# Altium schematic sheet PoE.SchDoc
size A2
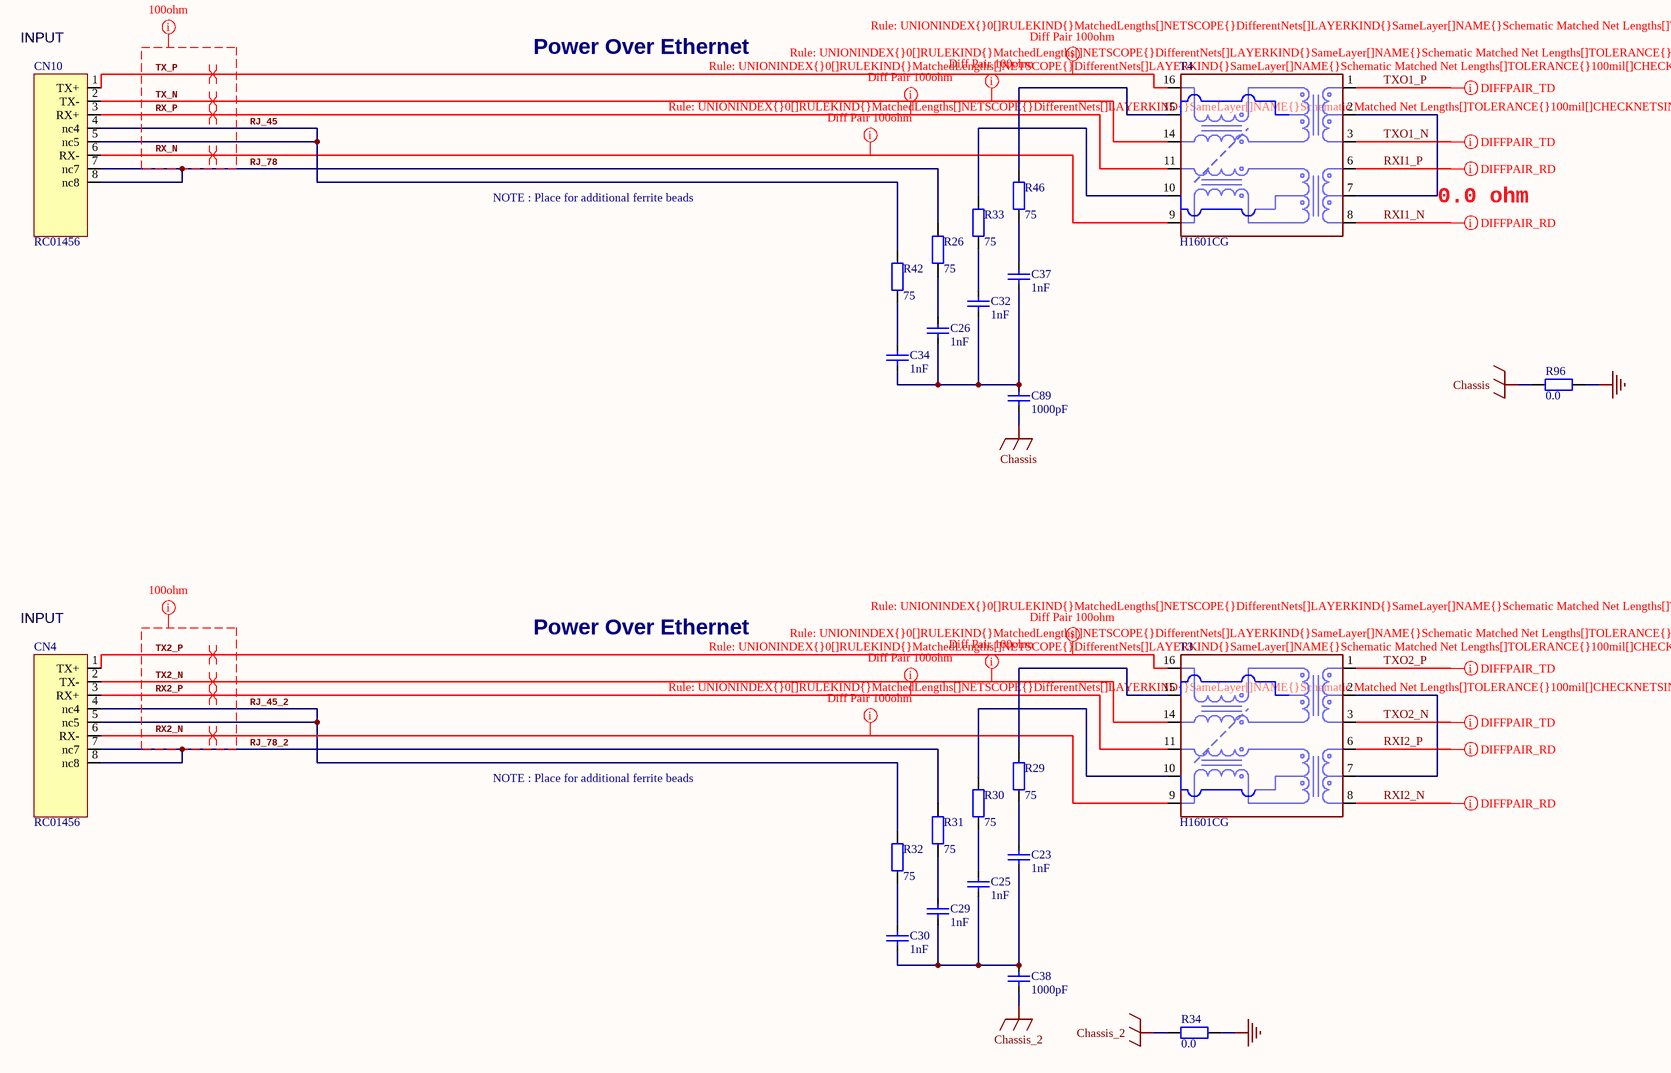
[diagram p0: PoE.SchDoc]

## Parts
C23  value 1nF  [CAP0603R]  (hidden comment: CL10B102KC8NNNC)
C25  value 1nF  [CAP0603R]  (hidden comment: CL10B102KC8NNNC)
C26  value 1nF  [CAP0603R]  (hidden comment: CL10B102KC8NNNC)
C29  value 1nF  [CAP0603R]  (hidden comment: CL10B102KC8NNNC)
C30  value 1nF  [CAP0603R]  (hidden comment: CL10B102KC8NNNC)
C32  value 1nF  [CAP0603R]  (hidden comment: CL10B102KC8NNNC)
C34  value 1nF  [CAP0603R]  (hidden comment: CL10B102KC8NNNC)
C37  value 1nF  [CAP0603R]  (hidden comment: CL10B102KC8NNNC)
C38  value 1000pF  [CAP1206R]  (hidden comment: CC1206KKX7RDBB102)
C89  value 1000pF  [CAP1206R]  (hidden comment: CC1206KKX7RDBB102)
CN4  RC01456  [HY506-Footprint-1]
CN10  RC01456  [HY506-Footprint-1]
R26  value 75  [0603]  (hidden comment: 0603WAF750JT5E)
R29  value 75  [0603]  (hidden comment: 0603WAF750JT5E)
R30  value 75  [0603]  (hidden comment: 0603WAF750JT5E)
R31  value 75  [0603]  (hidden comment: 0603WAF750JT5E)
R32  value 75  [0603]  (hidden comment: 0603WAF750JT5E)
R33  value 75  [0603]  (hidden comment: 0603WAF750JT5E)
R34  value 0.0  [0805]  (hidden comment: CMP-022-0137-1)
R42  value 75  [0603]  (hidden comment: 0603WAF750JT5E)
R46  value 75  [0603]  (hidden comment: 0603WAF750JT5E)
R96  value 0.0  [0805]  (hidden comment: CMP-022-0137-1)
T3  H1601CG  [TF-16SM]
T4  H1601CG  [TF-16SM]

## Nets
Chassis: C89.1 R96.1
Chassis_2: C38.1 R34.1
GND: R34.2 R96.2
RJ_45: CN10.4(nc4) CN10.5(nc5) R42.2
RJ_45_2: CN4.4(nc4) CN4.5(nc5) R32.2
RJ_78: CN10.7(nc7) CN10.8(nc8) R26.2
RJ_78_2: CN4.7(nc7) CN4.8(nc8) R31.2
RX2_N: CN4.6(RX-) T3.9(RX-)
RX2_P: CN4.3(RX+) T3.11(RX1+)
RX_N: CN10.6(RX-) T4.9(RX-)
RX_P: CN10.3(RX+) T4.11(RX1+)
RXI1_N: T4.8(RD-)
RXI1_P: T4.6(RD+)
RXI2_N: T3.8(RD-)
RXI2_P: T3.6(RD+)
TX2_N: CN4.2(TX-) T3.14(TX1-)
TX2_P: CN4.1(TX+) T3.16(TX1+)
TX_N: CN10.2(TX-) T4.14(TX1-)
TX_P: CN10.1(TX+) T4.16(TX1+)
TXO1_N: T4.3(TD-)
TXO1_P: T4.1(TD+)
TXO2_N: T3.3(TD-)
TXO2_P: T3.1(TD+)
NetC23_1: C23.1 C25.1 C29.1 C30.1 C38.2
NetC23_2: C23.2 R29.1
NetC25_2: C25.2 R30.1
NetC26_1: C26.1 C32.1 C34.1 C37.1 C89.2
NetC26_2: C26.2 R26.1
NetC29_2: C29.2 R31.1
NetC30_2: C30.2 R32.1
NetC32_2: C32.2 R33.1
NetC34_2: C34.2 R42.1
NetC37_2: C37.2 R46.1
NetR29_2: R29.2 T3.15(CT)
NetR30_2: R30.2 T3.10(CT)
NetR33_2: R33.2 T4.10(CT)
NetR46_2: R46.2 T4.15(CT)
NetT3_2: T3.2(CT) T3.7(CT)
NetT4_2: T4.2(CT) T4.7(CT)

## Layout directives
rule Matched Net Lengths [Tolerance = 100mil]: RX2_N, RX2_P, RX_N, RX_P, TX2_N, TX2_P, TX_N, TX_P
differential pair: RX2_N, RX2_P, RX_N, RX_P, RXI1_N, RXI1_P, RXI2_N, RXI2_P, TX2_N, TX2_P, TX_N, TX_P, TXO1_N, TXO1_P, TXO2_N, TXO2_P
net class 100ohm: RX2_N, RX2_P, RX_N, RX_P, TX2_N, TX2_P, TX_N, TX_P

## Notes on the sheet
- (near CN10) INPUT
- Power Over Ethernet
- NOTE : Place for additional ferrite beads
- 0.0 ohm
- (near CN4) INPUT

## Library data of the parts
C23 C25 C26 C29 C30 C32 C34 C37 = CMP-00190-1: CAP CER 1000PF 100V ±10% X7R 0603; Manufacturer: Samsung; Price: 0,0043; Tolerance: ±10%; Simulation: CAP; Voltage: 100V; PriceQty: 50; PriceSupplier: https://lcsc.com/product-detail/Multilayer-Ceramic-Capacitors-MLCC-SMD-SMT_SAMSUNG_CL10B102KC8NNNC_1nF-102-10-100V_C153291.html; Designator: CL10B102KC8NNNC; Signal Integrity: Cap; Pin Count: 2; HelpURL: https://lcsc.com/product-detail/Multilayer-Ceramic-Capacitors-MLCC-SMD-SMT_SAMSUNG_CL10B102KC8NNNC_1nF-102-10-100V_C153291.html; Component Name: CL10B102KC8NNNC; Part Number: CL10B102KC8NNNC; Technology: X7R; Temperature: -55°C ~ 125°C
C38 C89 = CMP-004-0061-2: CAP CER 1000PF 2KV ±10% X7R 1206; Manufacturer: Yageo; Tolerance: ±10%; Voltage: 2kV; Technology: X7R; Part Number: CC1206KKX7RDBB102; Temperature: -55°C ~ 125°C; HelpURL: https://www.digikey.com/product-detail/en/yageo/CC1206KKX7RDBB102/311-1487-1-ND/2833793; Price: 0,0114; PriceQty: 50; PriceSupplier: https://lcsc.com/product-detail/Multilayer-Ceramic-Capacitors-MLCC-SMD-SMT_YAGEO-CC1206KKX7RDBB102_C23631.html; Simulation: CAP; Signal Integrity: Cap; Component Name: CC1206KKX7RDBB102; Pin Count: 2
CN4 CN10 = CMP-00197-2: 8 Pin RJ45 Socket; Manufacturer: RCH; Price: 0,0476; PriceQty: 120; Designator: RC01456; PriceSupplier: https://lcsc.com/product-detail/Ethernet-Connectors-Modular-Connectors-RJ45-RJ11_RCH-RC01456_C708633.html; Part Number: RC01456; Pin Count: 8; Component Name: RC01456; Temperature: -40°c~85°c; HelpURL: https://lcsc.com/product-detail/Ethernet-Connectors-Modular-Connectors-RJ45-RJ11_RCH-RC01456_C708633.html
R26 R29-R33 R42 R46 = CMP-00189-1: RES SMD 75 OHM 1% 1/10W 0603; Manufacturer: Uniroyal; Pin Count: 2; Simulation: RESISTOR; HelpURL: https://lcsc.com/product-detail/Chip-Resistor-Surface-Mount_Uniroyal-Elec-0603WAF750JT5E_C4275.html; Price: 0,0023; Designator: 0603WAF750JT5E; PriceQty: 1; Part Number: 0603WAF750JT5E; Signal Integrity: Res; Tolerance: ±1%; PriceSupplier: https://lcsc.com/product-detail/Chip-Resistor-Surface-Mount_Uniroyal-Elec-0603WAF750JT5E_C4275.html; Temperature: -55°C ~ 155°C; Component Name: 0603WAF750JT5E
R34 R96 = CMP-022-0137-1: RES SMD 0 OHM JUMPER 1/8W 0805; Part Number: RC0805JR-070RL; Manufacturer: Yageo; Temperature: -55°C ~ 155°C; HelpURL: https://www.digikey.com/product-detail/en/yageo/RC0805JR-070RL/311-0.0ARCT-ND/731163; Price: 0,001203; PriceQty: 100; PriceSupplier: https://lcsc.com/product-detail/Chip-Resistor-Surface-Mount_YAGEO-RC0805JR-070RL_C96345.html; Component Name: RC0805JR-070RL; Pin Count: 2; Signal Integrity: Res; Simulation: RESISTOR
T3 T4 = CMP-00191-2: 1:1 350 -1.1 -18 SMD-16 RJ45 Transformer; Manufacturer: Dongguan; PriceQty: 1; Pin Count: 10; Component Name: H1601CG; HelpURL: https://lcsc.com/product-detail/RJ45-Transformer_Dongguan-Mentech-Optical-Magnetic-H1601CG_C194517.html; Price: 0,263; Temperature: H1601CG; Designator: H1601CG; Part Number: H1601CG; PriceSupplier: https://lcsc.com/product-detail/RJ45-Transformer_Dongguan-Mentech-Optical-Magnetic-H1601CG_C194517.html